# Altium schematic sheet 4_half.schdoc: Мостовой драйвер
size 420 x 297 mm; ApprovedBy: Мешков; CheckedBy: Черноскутов; Author: Соснин; CompanyName: РГППУ; Title2str: 2-Н моста; DecimalNumber: АБВГ.123456.001 33; Title3str: с ВИС-состоянием
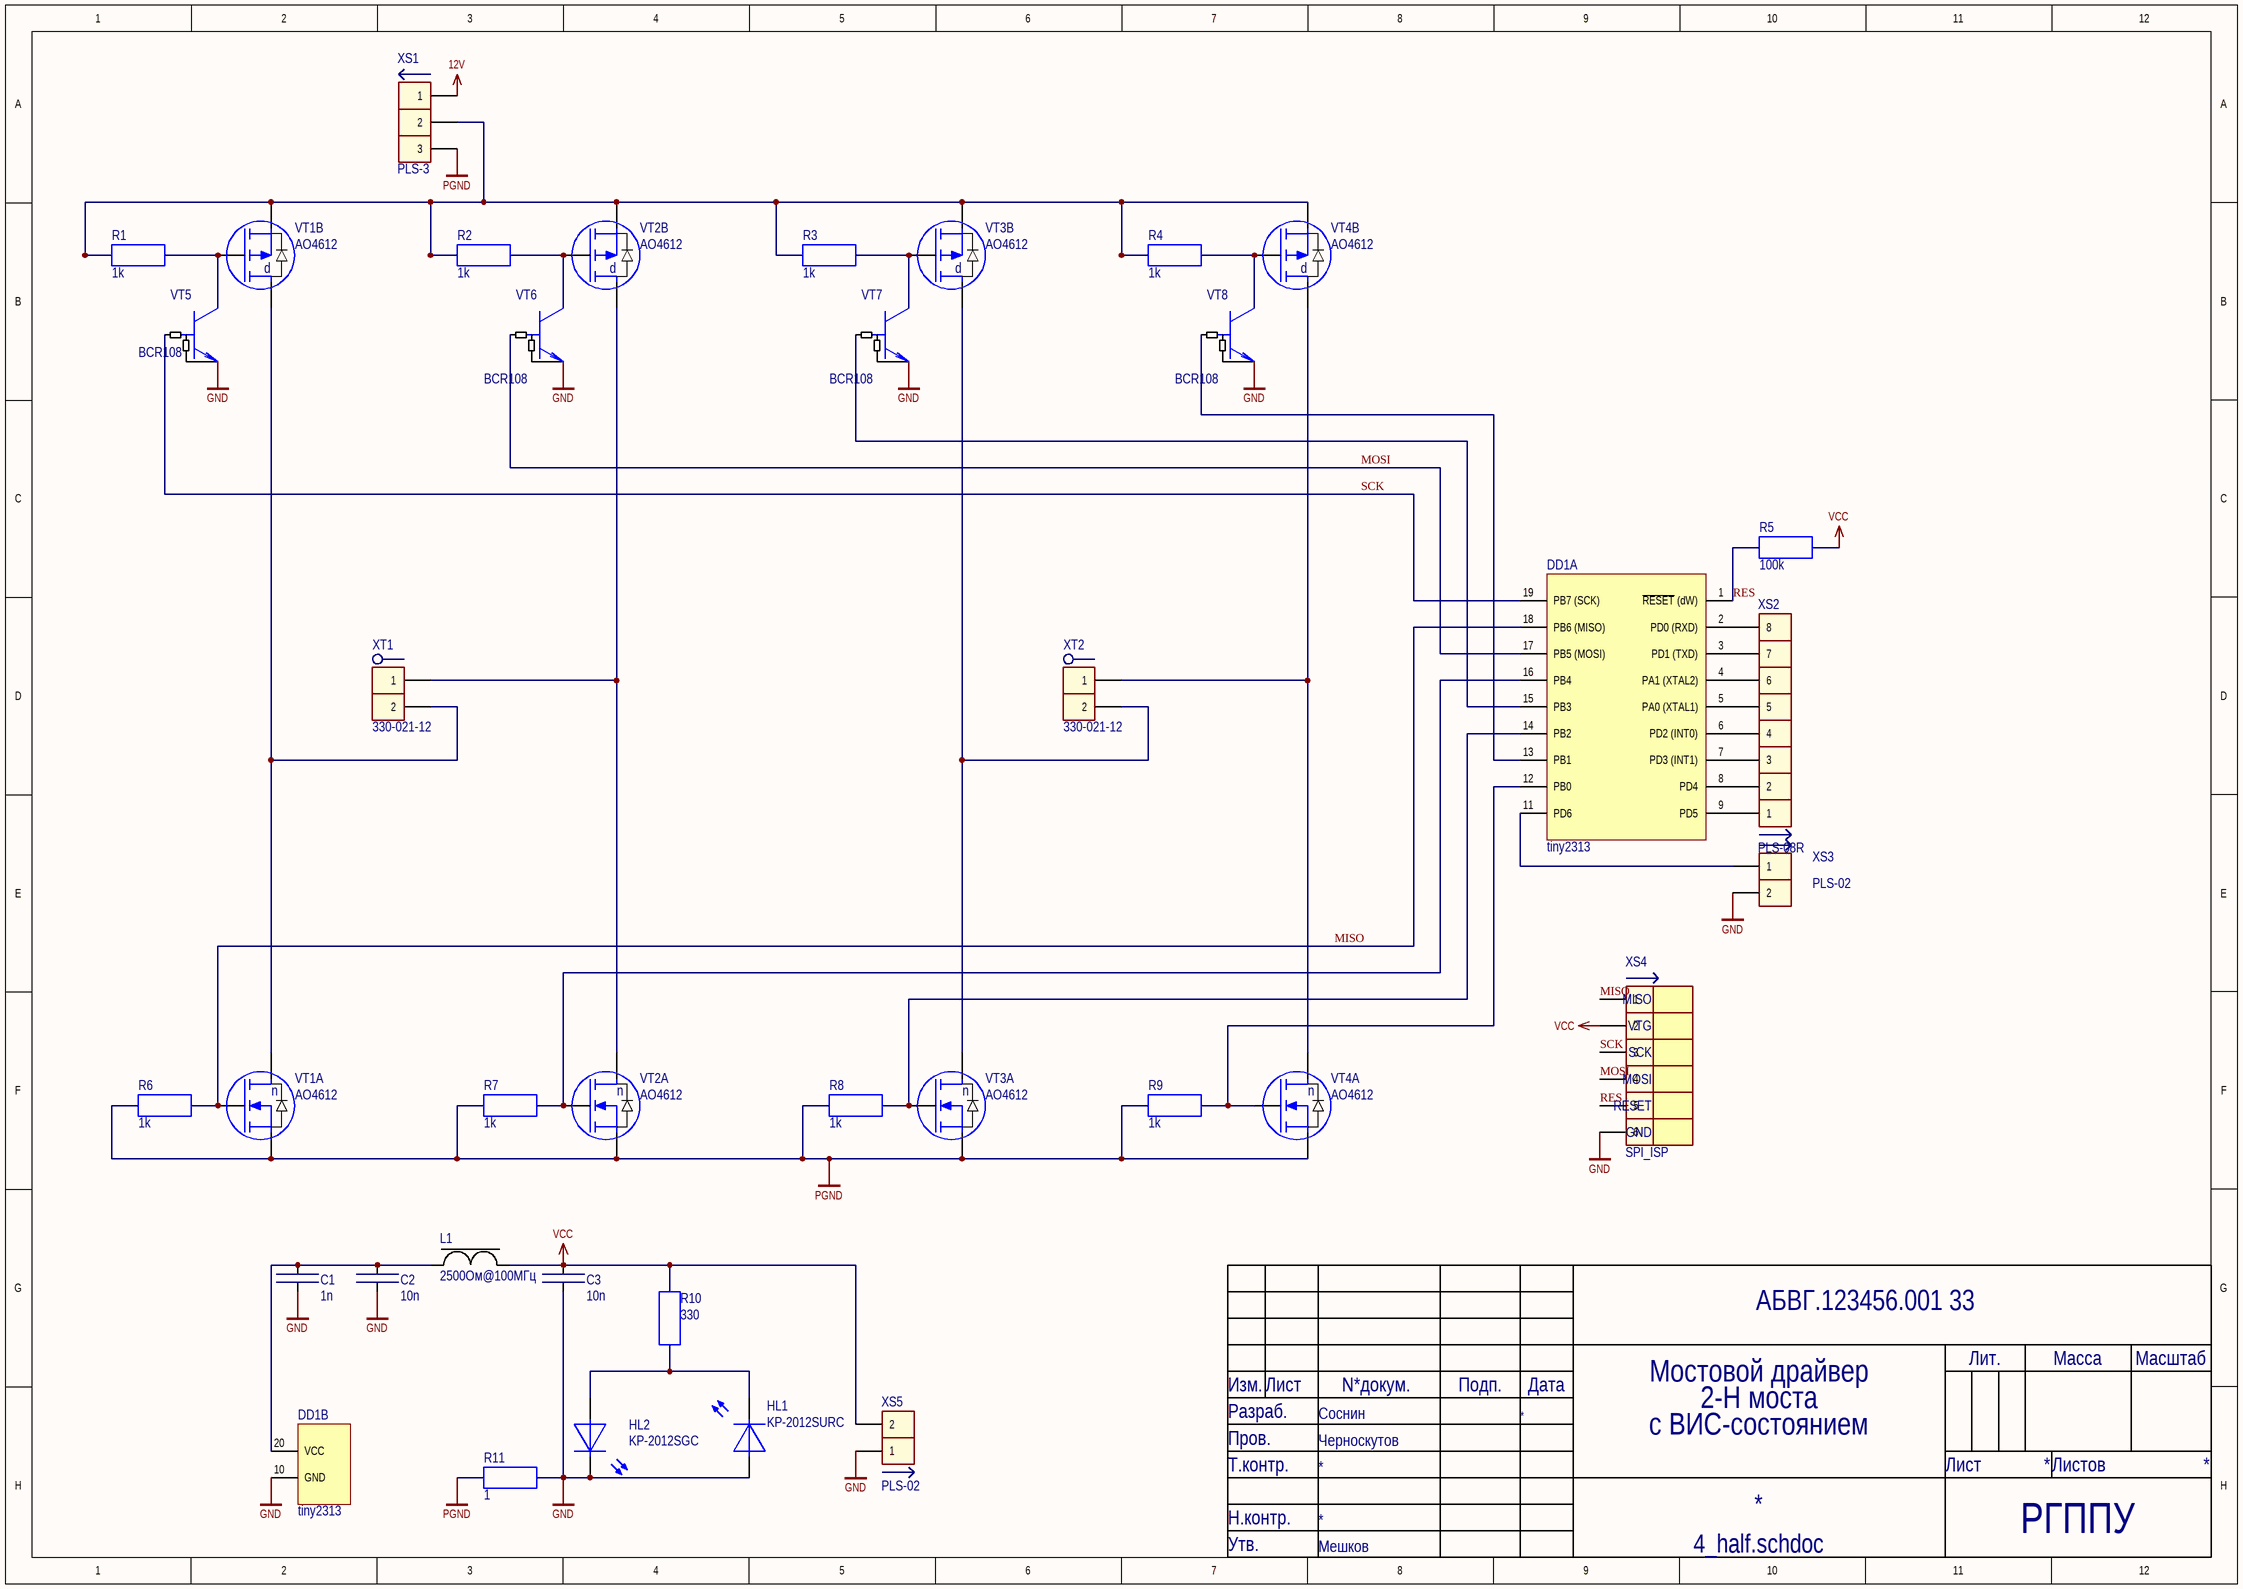
[diagram p0: 4_half.schdoc]

## Parts
C1  1n  [SMDRC0805]
C2  10n  [SMDRC0805]
C3  10n  [SMDRC0805]
DD1  tiny2313  [DIP20]  (parts A,B of 2)
HL1  KP-2012SURC  [DIOMELF2012M]
HL2  KP-2012SGC  [DIOMELF2012M]
L1  2500Ом@100МГц  [MMZ1608]
R1  1k  [SMDRC0805]
R2  1k  [SMDRC0805]
R3  1k  [SMDRC0805]
R4  1k  [SMDRC0805]
R5  100k  [SMDRC0805]
R6  1k  [SMDRC0805]
R7  1k  [SMDRC0805]
R8  1k  [SMDRC0805]
R9  1k  [SMDRC0805]
R10  330  [SMDRC0805]
R11  1  [SMDRC0805]
VT1  AO4612  [SOIC-8-Narrow]  (parts A,B of 2)
VT2  AO4612  [SOIC-8-Narrow]  (parts A,B of 2)
VT3  AO4612  [SOIC-8-Narrow]  (parts A,B of 2)
VT4  AO4612  [SOIC-8-Narrow]  (parts A,B of 2)
VT5  BCR108  [SOT95P245X110-3M]
VT6  BCR108  [SOT95P245X110-3M]
VT7  BCR108  [SOT95P245X110-3M]
VT8  BCR108  [SOT95P245X110-3M]
XS1  PLS-3  [PLS-03]
XS2  PLS-08R  [PLS-08R1]
XS3  PLS-02  [PLS-02]
XS4  SPI_ISP  [IDC-06M]
XS5  PLS-02  [PLS-02]
XT1  330-021-12  [330-021-12]
XT2  330-021-12  [330-021-12]

## Nets
12V: XS1.1
GND: C1.1 C2.1 C3.1 DD1.10(GND) HL1.1 HL2.2 R11.2 VT5.2(E) VT6.2(E) VT7.2(E) VT8.2(E) XS3.2 XS4.6 XS5.1
PGND: R6.1 R7.1 R8.1 R9.1 R11.1 VT1.1(S2) VT2.1(S2) VT3.1(S2) VT4.1(S2) XS1.3
VCC: C3.2 L1.2 R5.2 R10.2 XS4.2 XS5.2
MISO: DD1.18(PB6_(MISO)) R6.2 VT1.2(G2) XS4.1
MOSI: DD1.17(PB5_(MOSI)) VT6.1(B) XS4.4
RES: DD1.1(~{RESET}_(dW)) R5.1 XS4.5
SCK: DD1.19(PB7_(SCK)) VT5.1(B) XS4.3
NetC1_2: C1.2 C2.2 DD1.20(VCC) L1.1
NetDD1_2: DD1.2(PD0_(RXD)) XS2.8
NetDD1_3: DD1.3(PD1_(TXD)) XS2.7
NetDD1_4: DD1.4(PA1_(XTAL2)) XS2.6
NetDD1_5: DD1.5(PA0_(XTAL1)) XS2.5
NetDD1_6: DD1.6(PD2_(INT0)) XS2.4
NetDD1_7: DD1.7(PD3_(INT1)) XS2.3
NetDD1_8: DD1.8(PD4) XS2.2
NetDD1_9: DD1.9(PD5) XS2.1
NetDD1_11: DD1.11(PD6) XS3.1
NetDD1_12: DD1.12(PB0) R9.2 VT4.2(G2)
NetDD1_13: DD1.13(PB1) VT8.1(B)
NetDD1_14: DD1.14(PB2) R8.2 VT3.2(G2)
NetDD1_15: DD1.15(PB3) VT7.1(B)
NetDD1_16: DD1.16(PB4) R7.2 VT2.2(G2)
NetHL1_2: HL1.2 HL2.1 R10.1
NetR1_1: R1.1 R2.1 R3.1 R4.1 VT1.3(S1) VT2.3(S1) VT3.3(S1) VT4.3(S1) XS1.2
NetR1_2: R1.2 VT1.4(G1) VT5.3(C)
NetR2_2: R2.2 VT2.4(G1) VT6.3(C)
NetR3_2: R3.2 VT3.4(G1) VT7.3(C)
NetR4_2: R4.2 VT4.4(G1) VT8.3(C)
NetVT1_5: VT1.5(D1) VT1.8(D2) XT1.2
NetVT2_5: VT2.5(D1) VT2.8(D2) XT1.1
NetVT3_5: VT3.5(D1) VT3.8(D2) XT2.2
NetVT4_5: VT4.5(D1) VT4.8(D2) XT2.1

## Notes on the sheet
- Изм.
- Лист
- N*докум.
- Подп.
- Дата
- Лит.
- Масса
- Масштаб
- Разраб.
- Пров.
- Т.контр.
- Лиcт
- Лиcтов
- Н.контр.
- Утв.
- (in symbol AO4612, part A) n
- (in symbol AO4612, part B) p
- (in symbol Con6_M IDC-06M_SPI) MISO; VTG; SCK; MOSI; RESET; GND

## Library data of the parts
C1 = Capacitor 0805 1n: Generic capasitor non-polar; PartNumber: Capacitor 0805 1n; Value: 1n; ComponentLink1Description: Datasheet; Package: 0805
C2 C3 = Capacitor 0805 10n: Generic capasitor non-polar; PartNumber: Capacitor 0805 10n; Value: 10n; ComponentLink1Description: Datasheet; Package: 0805
DD1 = ATTINY2313A-PU: Microcontroller 8-bit; Manufacturer: Atmel; Package: 20-PDIP; Price: 53; ManufacturerPartNumber: ATTINY2313A-PU; Note: *; Supplier: Промэлектроника; ComponentLink1URL: http://www.atmel.com/images/doc8246.pdf; ComponentLink1Description: Datasheet
HL1 = LED1_R: Diod LED SMD Red; ComponentLink1Description: Datasheet; Price: 5,01; ComponentLink2Description: Datasheet-local; ComponentLink2URL: *; Color: Red; ManufacturerPartNumber: KP-2012SURC
HL2 = LED1_G: Diod LED SMD Green; ComponentLink1Description: Datasheet; Price: 2,88; ComponentLink2Description: Datasheet-local; ComponentLink2URL: *; Color: Green; ManufacturerPartNumber: KP-2012SGC
L1 = MMZ1608A252B: Феррит 2500Ом@100МГц; Manufacturer: TDK; ManufacturerPartNumber: MMZ1608A252B; ComponentLink1Description: Datasheet; ComponentLink1URL: http://product.tdk.com/en/catalog/datasheets/e9412_mmz.pdf; Price: 10.14; Package: 2012; Supplier: Промэлектроника; ComponentLink2Description: Datasheet-local; Value: 2500Ом@100МГц
R1-R4 R6-R9 = Resistor 0805 1k: Generic resistor; PartNumber: Resistor 0805 1k; Value: 1k; ComponentLink1URL: http://www.mouser.com/ds/2/447/PYu-RC0402_51_RoHS_L_6_r-8721.pdf; ComponentLink1Description: Datasheet; Package: 0805
R5 = Resistor 0805 100k: Generic resistor; PartNumber: Resistor 0805 100k; Value: 100k; ComponentLink1URL: http://www.mouser.com/ds/2/447/PYu-RC0402_51_RoHS_L_6_r-8721.pdf; ComponentLink1Description: Datasheet; Package: 0805
R10 = Resistor 0805 330: Generic resistor; PartNumber: Resistor 0805 330; Value: 330; ComponentLink1URL: http://www.mouser.com/ds/2/447/PYu-RC0402_51_RoHS_L_6_r-8721.pdf; ComponentLink1Description: Datasheet; Package: 0805
R11 = Resistor 0805 1: Generic resistor; PartNumber: Resistor 0805 1; Value: 1; ComponentLink1URL: http://www.mouser.com/ds/2/447/PYu-RC0402_51_RoHS_L_6_r-8721.pdf; ComponentLink1Description: Datasheet; Package: 0805
VT1-VT4 = AO4612: p-n пара комплиментарная 60В; Manufacturer: AO (Alpha & Omega semiconductor); ManufacturerPartNumber: AO4612; Note: *; Price: 34; Supplier: Промэлектроника; ComponentLink1URL: http://www.aosmd.com/pdfs/datasheet/AO4612.pdf; ComponentLink1Description: Datasheet
VT5-VT8 = BCR108E6327: n-p-n цифровой; Manufacturer: Infineon Technologies; ComponentLink1Description: Datasheet; ComponentLink1URL: http://www.infineon.com/dgdl/Infineon-BCR108SERIES-DS-v01_01-en.pdf?fileId=db3a30431428a37301143a27e5a401ce; Price: 2,98; Note: BCR108; Package: SOT23; Supplier: Промэлектроника; ManufacturerPartNumber: BCR108E6327
XS1 = Con3_M_PLS-3: Male 3-pin connection; ManufacturerPartNumber: partnumber; ManufacturerPartNumber: PLS-3; ComponentLink1Description: Datasheet; ComponentLink1URL: http://www.promelec.ru/catalog/406/1218/1224/1/24233/; ComponentLink2Description: Datasheet-local; ComponentLink2URL: *; Price: 1
XS2 = Con8_M PLS-08MR: Male 8-pin connection; ManufacturerPartNumber: partnumber; ManufacturerPartNumber: PLS-08R; ComponentLink1Description: Datasheet; ComponentLink1URL: http://www.promelec.ru/catalog/406/1218/1223/1/99528/; ComponentLink2Description: Datasheet-local; ComponentLink2URL: *; Price: 1
XS3 XS5 = Con2_M_PLS-02: Male 2-pin connection; Manufacturer: AUK; Note: Продаётся только как PLS-40 вилка; ManufacturerPartNumber: PLS-02; ComponentLink1Description: Datasheet; ComponentLink1URL: http://www.promelec.ru/catalog/406/1218/1224/1/24233/; Supplier: Промэлектроника; Price: 1
XS4 = Con6_M IDC-06M_SPI: SPI connector; ManufacturerPartNumber: IDC-06M; ComponentLink1Description: Datasheet; ComponentLink1URL: http://www.promelec.ru/catalog/406/1218/1223/1/156430/; ComponentLink2Description: Datasheet-local; ComponentLink2URL: *; Price: 1
XT1 XT2 = Con2_D 330-021-12: Demountable connection  2-pin; Manufacturer: Degson Electronics Co., Ltd; ManufacturerPartNumber: 330-021-12; ComponentLink1Description: Datasheet; ComponentLink1URL: http://www.promelec.ru/pdf/320,321,330,335.pdf; Price: 7,45; Supplier: Промэлектроника; ComponentLink2Description: Datasheet-local